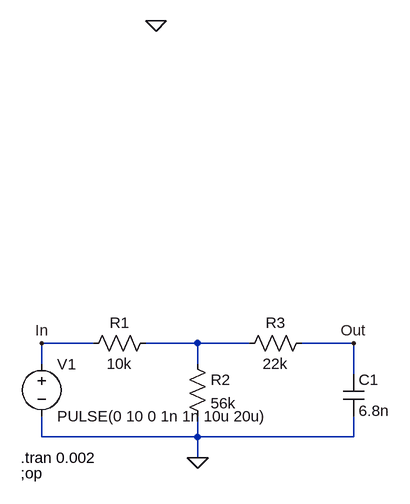
[diagram p0: schematic Lab2.asc]
Lab2.asc, the LTspice schematic file:
Version 4
SHEET 1 880 680
WIRE 0 80 -80 80
WIRE 160 80 80 80
WIRE 240 80 160 80
WIRE 400 80 320 80
WIRE -80 112 -80 80
WIRE 160 112 160 80
WIRE 400 128 400 80
WIRE -80 224 -80 192
WIRE 160 224 160 192
WIRE 160 224 -80 224
WIRE 400 224 400 192
WIRE 400 224 160 224
WIRE 160 256 160 224
FLAG 96 -416 0
FLAG 160 256 0
FLAG -80 80 In
FLAG 400 80 Out
SYMBOL res 96 64 R90
WINDOW 0 0 56 VBottom 2
WINDOW 3 32 56 VTop 2
SYMATTR InstName R1
SYMATTR Value 10k
SYMBOL res 144 96 R0
SYMATTR InstName R2
SYMATTR Value 56k
SYMBOL res 336 64 R90
WINDOW 0 0 56 VBottom 2
WINDOW 3 32 56 VTop 2
SYMATTR InstName R3
SYMATTR Value 22k
SYMBOL cap 384 128 R0
SYMATTR InstName C1
SYMATTR Value 6.8n
SYMBOL voltage -80 96 R0
WINDOW 123 0 0 Left 0
WINDOW 39 0 0 Left 0
SYMATTR InstName V1
SYMATTR Value PULSE(0 10 0 1n 1n 10u 20u)
TEXT -112 280 Left 2 !;op
TEXT -112 256 Left 2 !.tran 0.002

The netlist it stands for:
* Lab2.asc
R1 N001 In 10k
R2 N001 0 56k
R3 Out N001 22k
C1 Out 0 6.8n
V1 In 0 PULSE(0 10 0 1n 1n 10u 20u)
;op
.tran 0.002
.backanno
.end